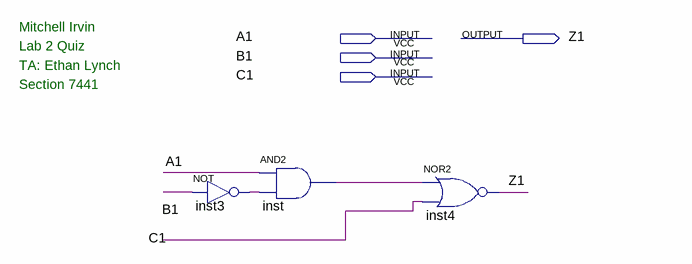
[diagram p0: schematic sheet]
// Quartus schematic lab2quiz.bdf as structural Verilog: 3 symbols, 4 pins
module lab2quiz (
  input  A1,
  input  B1,
  input  C1,
  output Z1
);

  wire inst3_out, inst_out;

  not inst3 (inst3_out, B1);
  and inst (inst_out, A1, inst3_out);
  nor inst4 (Z1, inst_out, C1);

  // Notes on the sheet:
  //   Mitchell Irvin
  //   Lab 2 Quiz
  //   TA: Ethan Lynch
  //   Section 7441
endmodule
